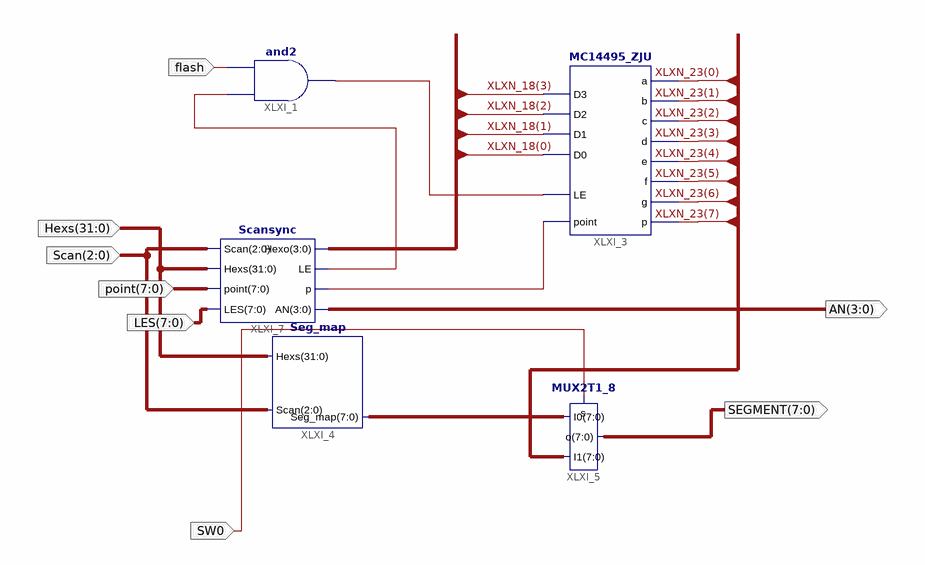
[diagram p0: schematic sheet 1]
// Xilinx ISE schematic Seg7_Dev.sch (kintex7) as structural Verilog: 5 symbols, 8 ports
module Seg7_Dev (
  input  flash,
  input  SW0,
  input  [31:0] Hexs,
  input  [2:0] Scan,
  input  [7:0] point,
  input  [7:0] LES,
  output [3:0] AN,
  output [7:0] SEGMENT
);

  wire XLXN_2, XLXN_13, XLXN_14;
  wire [3:0] XLXN_18;
  wire [7:0] XLXN_23, XLXN_39;

  and XLXI_1 (XLXN_14, XLXN_2, flash);
  MC14495_ZJU XLXI_3 (
    .D0(XLXN_18[0]), .D1(XLXN_18[1]), .D2(XLXN_18[2]), .D3(XLXN_18[3]), .p(XLXN_23[7]), .g(XLXN_23[6]),
    .f(XLXN_23[5]), .e(XLXN_23[4]), .d(XLXN_23[3]), .c(XLXN_23[2]), .b(XLXN_23[1]), .a(XLXN_23[0]),
    .point(XLXN_13), .LE(XLXN_14));
  Seg_map XLXI_4 (.Hexs(Hexs), .Seg_map(XLXN_39), .Scan(Scan));
  MUX2T1_8 XLXI_5 (.o(SEGMENT), .I0(XLXN_39), .s(SW0), .I1(XLXN_23));
  Scansync XLXI_7 (
    .Hexs(Hexs), .Scan(Scan), .point(point), .LES(LES), .p(XLXN_13), .LE(XLXN_2), .Hexo(XLXN_18), .AN(AN));
endmodule
